# EAGLE design 7segement4digits1badidea-shield-mk-5 (EAGLE 6.5.0)
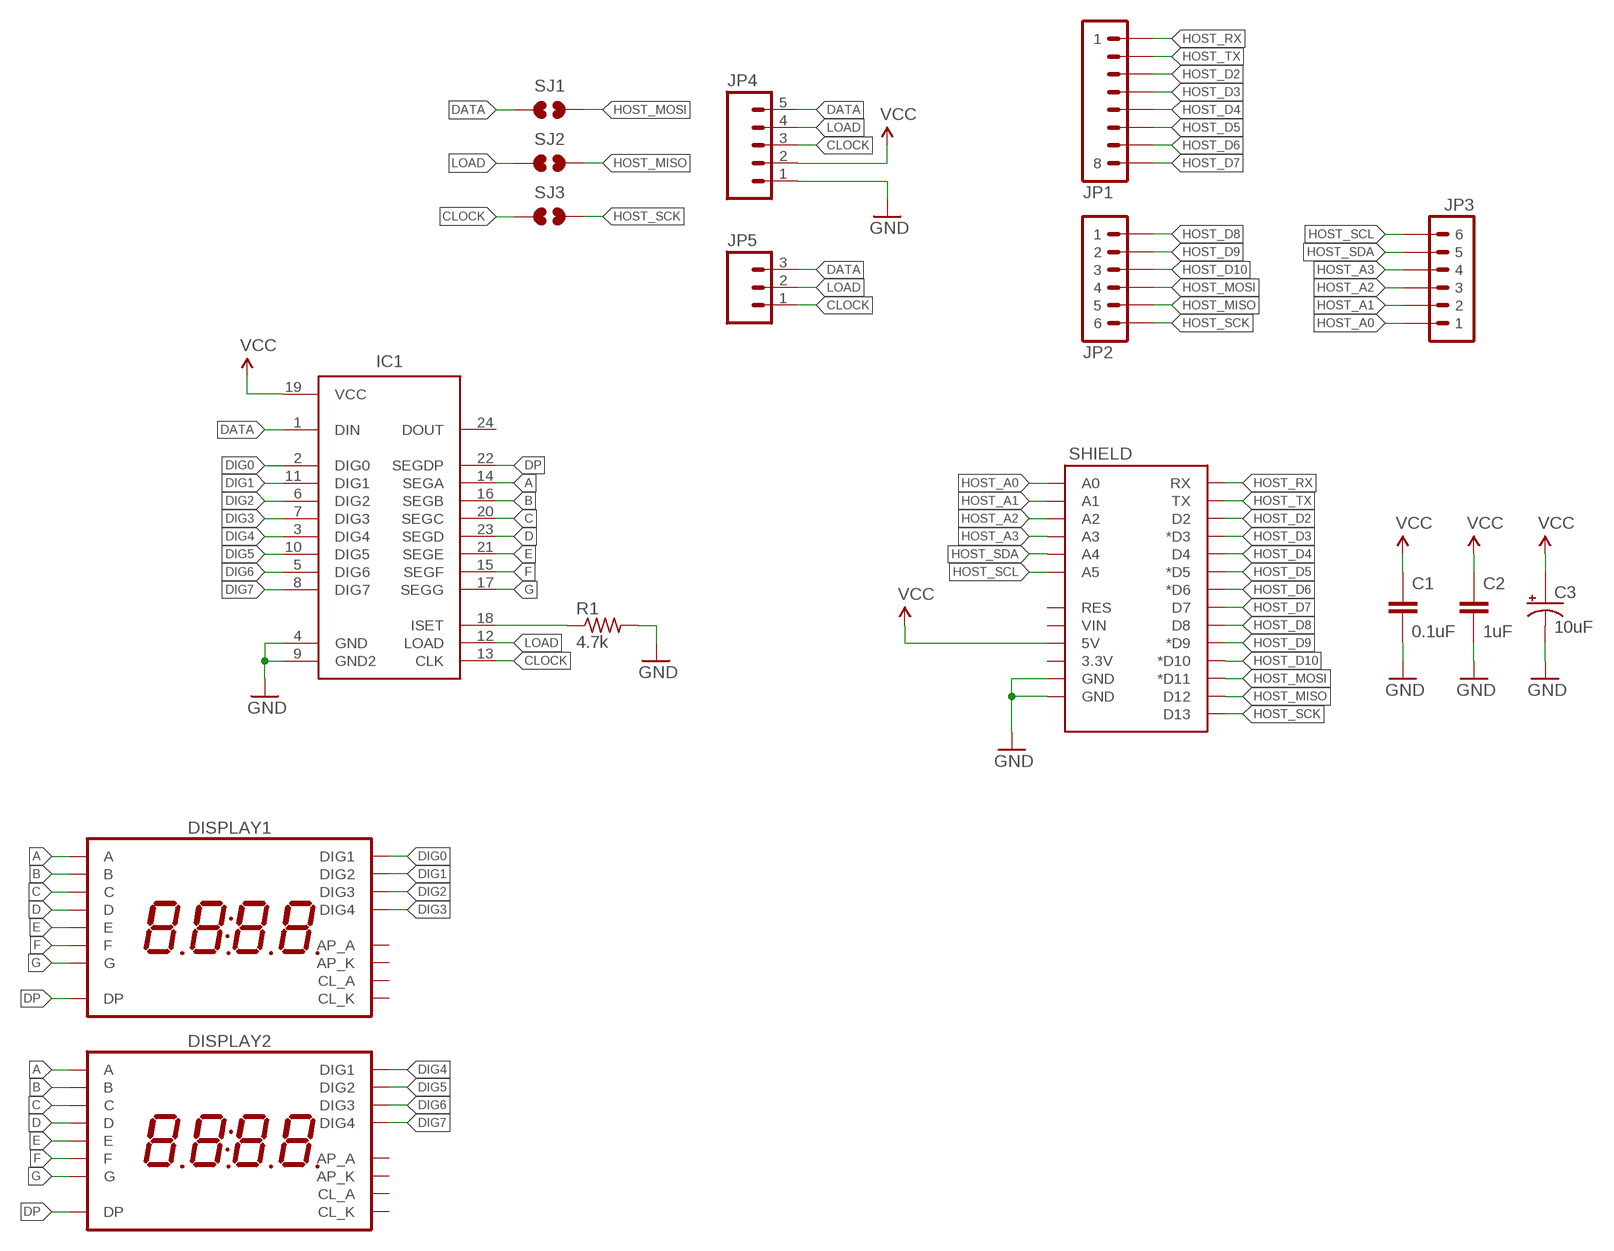
[diagram p0: schematic, sheet 1]

## Parts
C1  0.1uF  CAPACITOR-CERAMIC025-024X044  [C025-024X044]
C2  1uF  CAPACITOR-CERAMIC025-024X044  [C025-024X044]
C3  10uF  CAPACITOR-POLARIZEDE2.5-6  [E2,5-6]
DISPLAY1  7SEG_4DIGIT_10MM  [7SEG_4DIG_10MM]
DISPLAY2  7SEG_4DIGIT_10MM  [7SEG_4DIG_10MM]
IC1  MAX7219DIP  [DIL24]
JP1  M08NOT-SHITTY-NO-SILK  [1X08_NS]
JP2  M06SIP  [1X06]
JP3  M06SIP  [1X06]
JP4  M05PTH  [1X05]
JP5  M031X03_NO_SILK  [1X03_NO_SILK]
R1  4.7k  RESISTORPTH-AXIAL-5.08MM  [RESISTOR-AXIAL-PTH-5.08MM]
SHIELD  ARDUINO_SHIELD_SMALLERNEKKID  [ARDUINO_SHIELD_SMALLER_NEKKID]
SJ1  JUMPER-PAD-2-NOYES_SILK  [PAD-JUMPER-2-NO_YES_SILK]
SJ2  JUMPER-PAD-2-NOYES_SILK  [PAD-JUMPER-2-NO_YES_SILK]
SJ3  JUMPER-PAD-2-NOYES_SILK  [PAD-JUMPER-2-NO_YES_SILK]

## Nets
A: DISPLAY1.14(A) DISPLAY2.14(A) IC1.14(SEGA)
B: DISPLAY1.16(B) DISPLAY2.16(B) IC1.16(SEGB)
C: DISPLAY1.13(C) DISPLAY2.13(C) IC1.20(SEGC)
CLOCK: IC1.13(CLK) JP4.3 JP5.1 SJ3.1
D: DISPLAY1.3(D) DISPLAY2.3(D) IC1.23(SEGD)
DATA: IC1.1(DIN) JP4.5 JP5.3 SJ1.1
DIG0: DISPLAY1.1(DIG1) IC1.2(DIG0)
DIG1: DISPLAY1.2(DIG2) IC1.11(DIG1)
DIG2: DISPLAY1.6(DIG3) IC1.6(DIG2)
DIG3: DISPLAY1.8(DIG4) IC1.7(DIG3)
DIG4: DISPLAY2.1(DIG1) IC1.3(DIG4)
DIG5: DISPLAY2.2(DIG2) IC1.10(DIG5)
DIG6: DISPLAY2.6(DIG3) IC1.5(DIG6)
DIG7: DISPLAY2.8(DIG4) IC1.8(DIG7)
DP: DISPLAY1.7(DP) DISPLAY2.7(DP) IC1.22(SEGDP)
E: DISPLAY1.5(E) DISPLAY2.5(E) IC1.21(SEGE)
F: DISPLAY1.11(F) DISPLAY2.11(F) IC1.15(SEGF)
G: DISPLAY1.15(G) DISPLAY2.15(G) IC1.17(SEGG)
GND: C1.2 C2.2 C3.- IC1.4(GND) IC1.9(GND2) JP4.1 R1.P$2 SHIELD.GND@0(GND) SHIELD.GND@1(GND)
HOST_A0: JP3.1 SHIELD.A0
HOST_A1: JP3.2 SHIELD.A1
HOST_A2: JP3.3 SHIELD.A2
HOST_A3: JP3.4 SHIELD.A3
HOST_D2: JP1.3 SHIELD.D2
HOST_D3: JP1.4 SHIELD.D3(*D3)
HOST_D4: JP1.5 SHIELD.D4
HOST_D5: JP1.6 SHIELD.D5(*D5)
HOST_D6: JP1.7 SHIELD.D6(*D6)
HOST_D7: JP1.8 SHIELD.D7
HOST_D8: JP2.1 SHIELD.D8
HOST_D9: JP2.2 SHIELD.D9(*D9)
HOST_D10: JP2.3 SHIELD.D10(*D10)
HOST_MISO: JP2.5 SHIELD.D12 SJ2.2
HOST_MOSI: JP2.4 SHIELD.D11(*D11) SJ1.2
HOST_RX: JP1.1 SHIELD.RX
HOST_SCK: JP2.6 SHIELD.D13 SJ3.2
HOST_SCL: JP3.6 SHIELD.A5
HOST_SDA: JP3.5 SHIELD.A4
HOST_TX: JP1.2 SHIELD.TX
LOAD: IC1.12(LOAD) JP4.4 JP5.2 SJ2.1
N$19: IC1.18(ISET) R1.P$1
VCC: C1.1 C2.1 C3.+ IC1.19(VCC) JP4.2 SHIELD.5V
Unconnected: DISPLAY1.4(CL_A) DISPLAY1.9(AP_K) DISPLAY1.10(AP_A) DISPLAY1.12(CL_K) DISPLAY2.4(CL_A) DISPLAY2.9(AP_K) DISPLAY2.10(AP_A) DISPLAY2.12(CL_K) IC1.24(DOUT) SHIELD.3.3V SHIELD.RES SHIELD.VIN

## Library data of the parts
C1 C2 = A_butts:CAPACITOR-CERAMIC: CAPACITOR, European symbol
C3 = A_butts:CAPACITOR-POLARIZED: POLARIZED CAPACITOR, American symbol
DISPLAY1 DISPLAY2 = A_butts:7SEG_4DIGIT_10MM
IC1 = A_butts:MAX7219: 8-digit, 8-segment LED display driver, serial input
JP1 = A_butts:M08: Header 8 Standard 8-pin 0.1" header. Use with straight break away headers (SKU : PRT-00116), right angle break away headers (PRT-00553), swiss pins (PRT-00743), machine pins (PRT-00117), and female headers (PRT-00115).
JP2 JP3 = A_butts:M06: Header 6 Standard 6-pin 0.1" header. Use with straight break away headers (SKU : PRT-00116), right angle break away headers (PRT-00553), swiss pins (PRT-00743), machine pins (PRT-00117), and female headers (PRT-00115). Molex polarized connector foot print use with SKU : PRT-08094 with associated crimp pins and housings. NOTES ON THE VARIANTS LOCK and LOCK_LONGPADS... This footprint was designed to help hold the alignment of a through-hole component (i.e. 6-pin header) while soldering it into place. You may notice that each hole has been shifted either up or down by 0.005 of an inch from it's more standard position (which is a perfectly straight line). This slight alteration caused the pins (the squares in the middle) to touch the edges of the holes. Because they are alternating, it causes a "brace" to hold the component in place. 0.005 has proven to be the perfect amount of "off-center" position when using our standard breakaway headers. Although looks a little odd when you look at the bare footprint, once you have a header in there, the alteration is very hard to notice. Also,if you push a header all the way into place, it is covered up entirely on the bottom side. This idea of altering the position of holes to aid alignment will be further integrated into the Sparkfun Library for other footprints. It can help hold any component with 3 or more connection pins.
JP4 = A_butts:M05: Header 5 Standard 5-pin 0.1" header. Use with straight break away headers (SKU : PRT-00116), right angle break away headers (PRT-00553), swiss pins (PRT-00743), machine pins (PRT-00117), and female headers (PRT-00115). Molex polarized connector foot print use with SKU : PRT-08230 with associated crimp pins and housings.
JP5 = A_butts:M03: Header 3 Standard 3-pin 0.1" header. Use with straight break away headers (SKU : PRT-00116), right angle break away headers (PRT-00553), swiss pins (PRT-00743), machine pins (PRT-00117), and female headers (PRT-00115). Molex polarized connector foot print use with SKU : PRT-08232 with associated crimp pins and housings.
R1 = A_butts:RESISTOR: RESISTOR, American symbol
SHIELD = A_butts:ARDUINO_SHIELD_SMALLER
SJ1-SJ3 = A_butts:JUMPER-PAD-2-NO

## Board
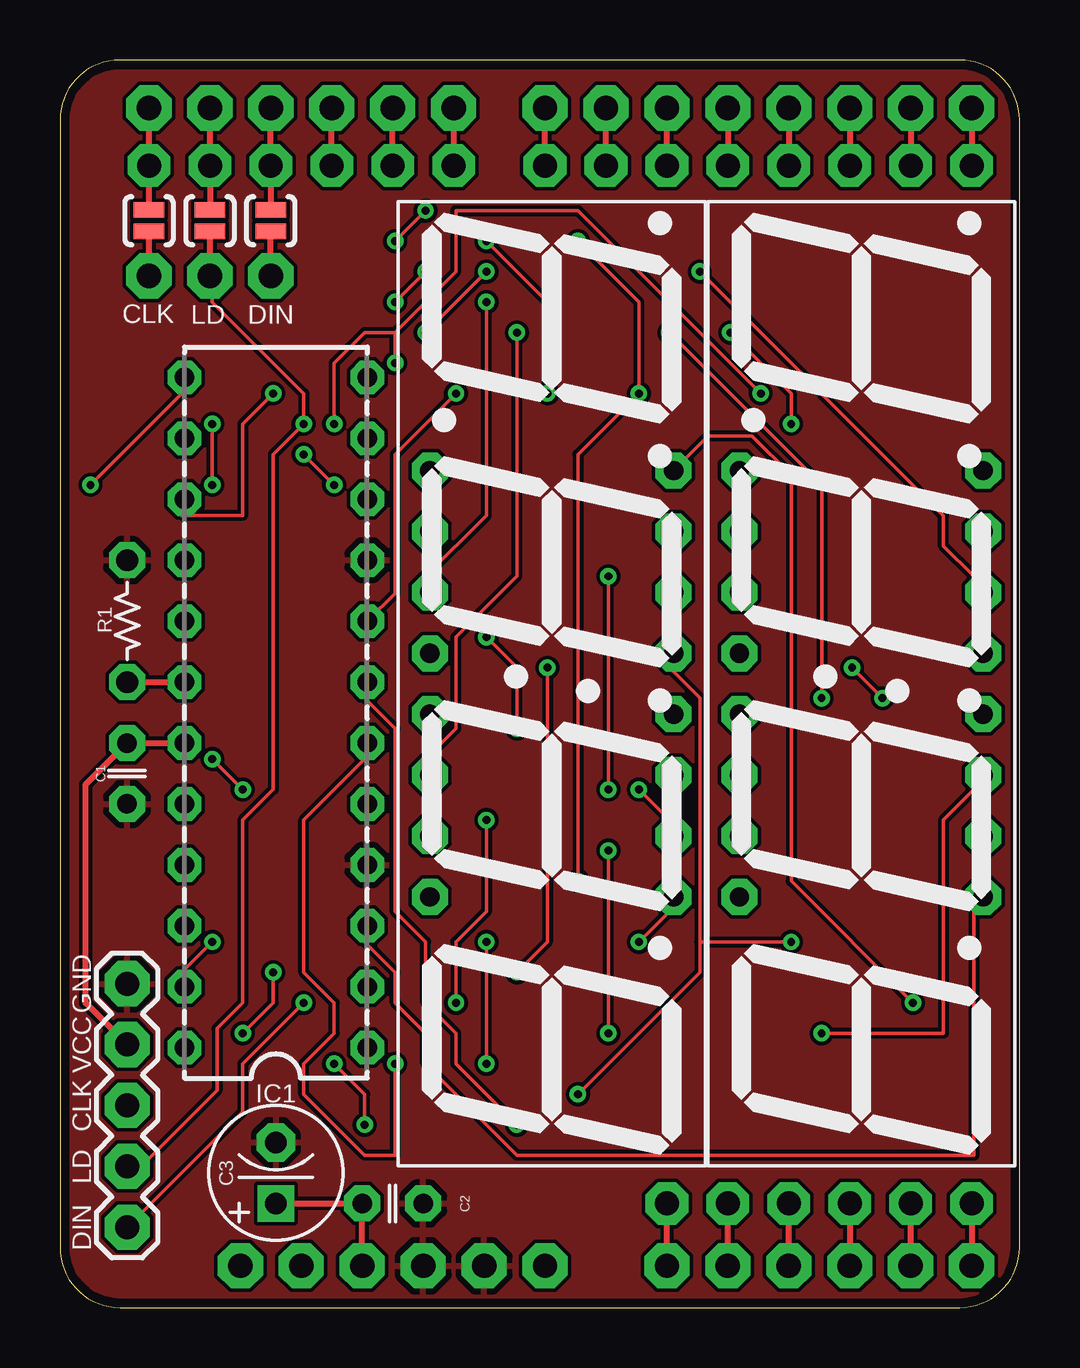
[diagram p1: board, top side]
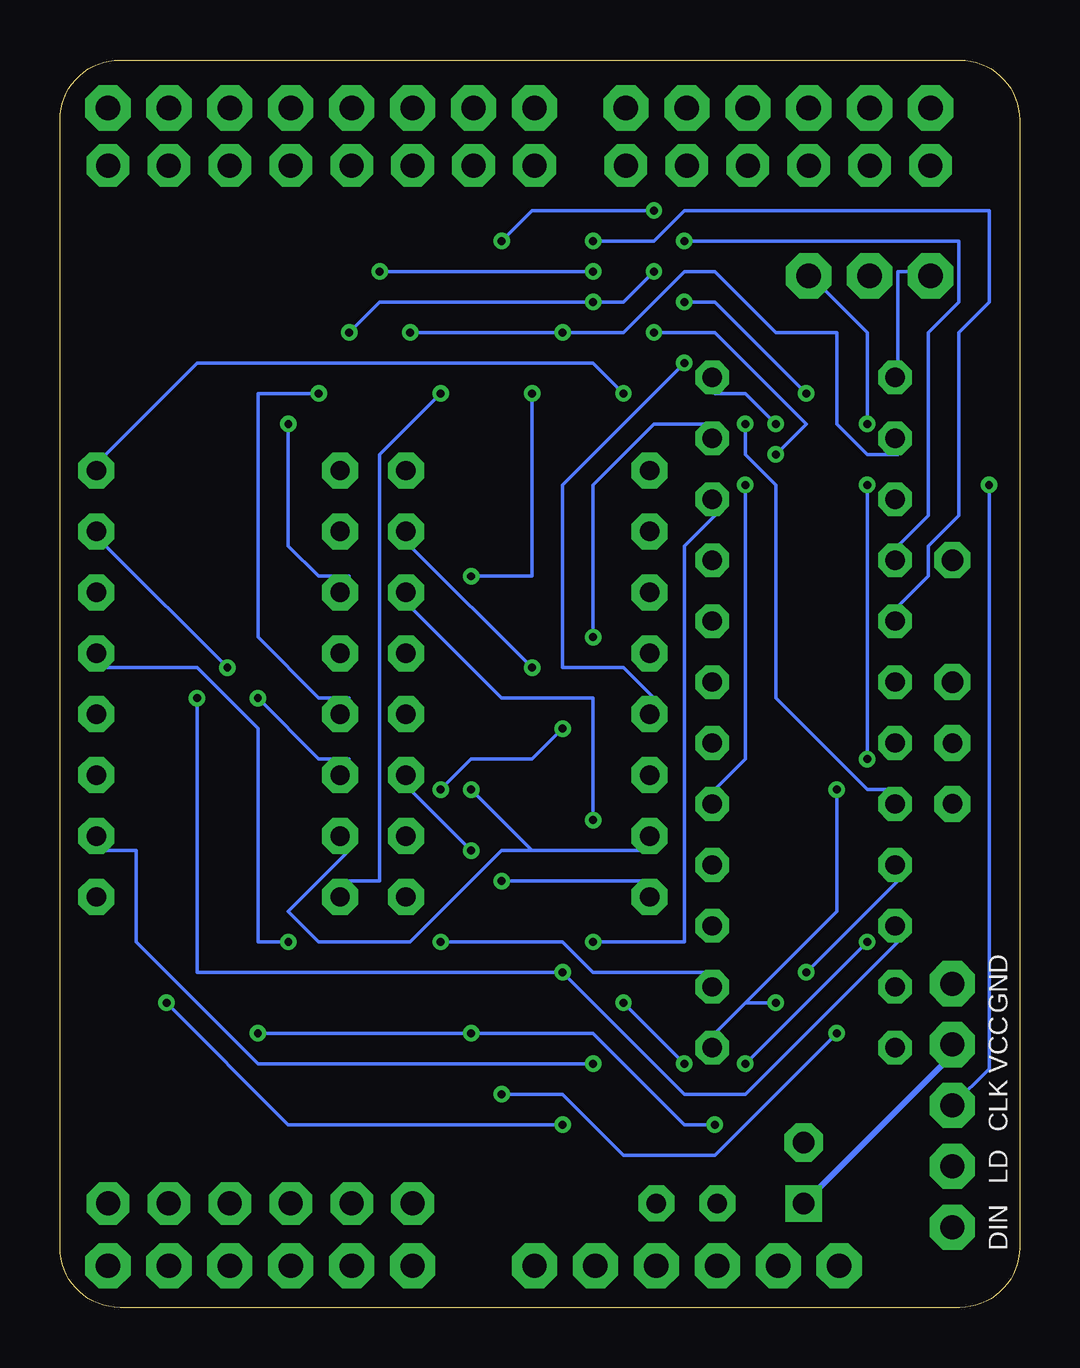
[diagram p2: board, bottom side, seen from below]

Size 40 x 52 mm. Coordinates in mm from the lower left corner, seen from the top.
Outline: 2.5,0 37.5,0 arc90 40,2.5 40,49.5 arc90 37.5,52 2.5,52 arc90 0,49.5 0,2.5 arc90 2.5,0
Copper layers (1*16): Top 0.0356mm / dielectric 1.5011mm / Bottom 0.0356mm
Design rules "LaenPCBOrder_2": minimum track width 6mil, minimum drill 13mil, track to track 6mil, track to pad 6mil, pad to pad 6mil, via to via 6mil, smd to smd 6mil, copper to edge 15mil, drill to drill 6mil, minimum pad ring 7mil, minimum via ring 7mil, stop-mask expansion 3mil, vias tented up to drill 20mil, thermal gap 10mil

### Footprints (pad centres in the part's own frame; a part is rotated, then mirrored left to right if it is on the bottom)
C025-024X044 = drill 0.813 pad 1.5 octagon: 1 -1.27,0; 2 1.27,0
E2,5-6 = drill 0.9 pad 1.524 square: + -1.27,0 | drill 0.9 pad 1.6 octagon: - 1.27,0
7SEG_4DIG_10MM = drill 0.8 pad 1.5 octagon: 1 -8.89,-5.08; 2 -6.35,-5.08; 3 -3.81,-5.08; 4 -1.27,-5.08; 5 1.27,-5.08; 6 3.81,-5.08; 7 6.35,-5.08; 8 8.89,-5.08; 9 8.89,5.08; 10 6.35,5.08; 11 3.81,5.08; 12 1.27,5.08; 13 -1.27,5.08; 14 -3.81,5.08; 15 -6.35,5.08; 16 -8.89,5.08
DIL24 = drill 0.8 pad 1.4 octagon: 1 -13.97,-3.81; 2 -11.43,-3.81; 3 -8.89,-3.81; 4 -6.35,-3.81; 5 -3.81,-3.81; 6 -1.27,-3.81; 7 1.27,-3.81; 8 3.81,-3.81; 9 6.35,-3.81; 10 8.89,-3.81; 11 11.43,-3.81; 12 13.97,-3.81; 13 13.97,3.81; 14 11.43,3.81; 15 8.89,3.81; 16 6.35,3.81; 17 3.81,3.81; 18 1.27,3.81; 19 -1.27,3.81; 20 -3.81,3.81; 21 -6.35,3.81; 22 -8.89,3.81; 23 -11.43,3.81; 24 -13.97,3.81
1X08_NS = drill 1 pad 1.778 octagon: 1 0,0; 2 2.54,0; 3 5.08,0; 4 7.62,0; 5 10.16,0; 6 12.7,0; 7 15.24,0; 8 17.78,0
1X06 = drill 1 pad 1.778 octagon: 1 0,0; 2 2.54,0; 3 5.08,0; 4 7.62,0; 5 10.16,0; 6 12.7,0
1X05 = drill 1 pad 1.88 octagon: 1 0,0; 2 2.54,0; 3 5.08,0; 4 7.62,0; 5 10.16,0
1X03_NO_SILK = drill 1.016 pad 1.88 octagon: 1 0,0; 2 2.54,0; 3 5.08,0
RESISTOR-AXIAL-PTH-5.08MM = drill 0.9 pad 1.5 octagon: P$1 -2.54,0; P$2 2.54,0
ARDUINO_SHIELD_SMALLER_NEKKID = drill 1.016 pad 1.88 octagon: 3.3V 48.26,-27.94; 5V 48.26,-25.4; A0 48.26,-12.7; A1 48.26,-10.16; A2 48.26,-7.62; A3 48.26,-5.08; A4 48.26,-2.54; A5 48.26,0; D2 0,-5.08; D3 0,-7.62; D4 0,-10.16; D5 0,-12.7; D6 0,-15.24; D7 0,-17.78; D8 0,-21.59; D9 0,-24.13; D10 0,-26.67; D11 0,-29.21; D12 0,-31.75; D13 0,-34.29; GND@0 48.26,-22.86; GND@1 48.26,-20.32; RES 48.26,-30.48; RX 0,0; TX 0,-2.54; VIN 48.26,-17.78
PAD-JUMPER-2-NO_YES_SILK = smd 0.635 x 1.27: 1 -0.45,0; 2 0.45,0

### Placement (x,y rotation side)
C1  2.8,22.26 270 top
C2  13.87,4.34 0 top
C3  9,5.61 90 top
DISPLAY1  20.5,26 90 top
DISPLAY2  33.4,26 90 top
IC1  9,24.8 90 top
JP1  38,47.6 180 top
JP2  16.41,47.6 180 top
JP3  25.3,4.34 0 top
JP4  2.8,13.5 270 top
JP5  3.71,43 0 top
R1  2.8,28.61 90 top
SHIELD  38,50 270 top
SJ1  8.79,45.3 90 top
SJ2  6.25,45.3 90 top
SJ3  3.71,45.3 90 top

### Tracks (layer width: path | path; a pad name or v marks a point on that pad's centre or on a via)
A  (via drill 0.33)
  Top 0.152: v19.05,40.64 19.05,30.48 16.51,27.94 16.51,24.13 15.24,22.86 DISPLAY1.14 | v31.75,25.4 31.75,34.29 v25.4,40.64
  Bottom 0.152: IC1.14 5.08,35.56 6.35,35.56 7.62,36.83 7.62,40.64 10.16,40.64 12.7,43.18 13.97,43.18 16.51,40.64 v19.05,40.64 v25.4,40.64 | v31.75,25.4 29.21,22.86 27.94,22.86 DISPLAY2.14
B  (via drill 0.33)
  Top 0.152: v15.24,45.72 v13.97,44.45 | v21.59,44.45 24.13,41.91 v24.13,38.1 21.59,35.56 v21.59,17.78
  Bottom 0.152: v13.97,44.45 2.54,44.45 2.54,41.91 3.81,40.64 3.81,33.02 5.08,31.75 IC1.16 | v15.24,45.72 20.32,45.72 v21.59,44.45 | v24.13,38.1 26.67,35.56 26.67,17.78 27.94,17.78 DISPLAY2.16 | v21.59,17.78 15.24,17.78 DISPLAY1.16
C  (via drill 0.33)
  Top 0.152: v11.43,36.83 11.43,39.37 12.7,40.64 13.97,40.64 | v13.97,39.37 13.97,40.64 | v29.21,38.1 21.59,45.72 16.51,45.72 16.51,43.18 13.97,40.64
  Bottom 0.152: v11.43,36.83 11.43,35.56 10.16,34.29 10.16,25.4 6.35,21.59 5.08,21.59 IC1.20 | v13.97,39.37 19.05,34.29 19.05,26.67 16.51,26.67 15.24,25.4 DISPLAY1.13 | v29.21,38.1 31.75,38.1 31.75,27.94 29.21,25.4 27.94,25.4 DISPLAY2.13
CLOCK  (via drill 0.33)
  Top 0.152: v1.27,34.29 5.08,38.1 IC1.13
  Top 0.25: JP5.1 SJ3.1
  Bottom 0.152: IC1.13 5.08,39.37 5.08,43.18 3.81,43.18 JP5.1 | v1.27,34.29 1.27,9.95 JP4.3
D  (via drill 0.33)
  Top 0.152: v6.35,15.24 5.08,13.97 IC1.23 | v11.43,10.16 12.7,8.89 v12.7,7.62 | v31.75,11.43 36.83,11.43 36.83,20.32 38.1,21.59 DISPLAY2.3 | v22.86,11.43 v22.86,19.05
  Bottom 0.152: v11.43,10.16 v6.35,15.24 | v12.7,7.62 13.97,7.62 17.78,11.43 v22.86,11.43 v31.75,11.43 | v22.86,19.05 25.4,21.59 DISPLAY1.3
DATA  (via drill 0.33)
  Top 0.152: v10.16,12.7 7.62,10.16 7.62,8.16 JP4.5 | v6.35,34.29 v6.35,36.83 | v7.62,21.59 v6.35,22.86
  Top 0.25: JP5.3 SJ1.1
  Bottom 0.152: 11.43,12.7 12.7,11.43 IC1.1 | v10.16,12.7 11.43,12.7 | v6.35,36.83 6.35,40.64 8.89,43.18 JP5.3 | v6.35,22.86 v6.35,34.29 | v7.62,21.59 7.62,16.51 11.43,12.7
DIG0  (via drill 0.33)
  Top 0.152: v24.13,15.24 25.4,16.51 DISPLAY1.1
  Bottom 0.152: v24.13,15.24 19.05,15.24 17.78,13.97 12.7,13.97 IC1.2
DIG1  (via drill 0.33)
  Top 0.152: v17.78,27.94 19.05,26.67 v19.05,24.13 | v24.13,21.59 25.4,20.32 DISPLAY1.2
  Bottom 0.152: v17.78,27.94 17.78,34.29 15.24,36.83 12.7,36.83 IC1.11 | v19.05,24.13 20.32,22.86 22.86,22.86 v24.13,21.59
DIG2  (via drill 0.33)
  Top 0.152: v13.97,10.16 13.97,6.35 12.7,6.35 10.16,8.89 10.16,10.16 11.43,11.43 11.43,12.7 10.16,13.97 10.16,20.32 12.7,22.86 IC1.6 | v16.51,12.7 16.51,15.24 17.78,16.51 v17.78,20.32
  Bottom 0.152: v16.51,12.7 v13.97,10.16 | v17.78,20.32 17.78,25.4 21.59,25.4 25.4,29.21 DISPLAY1.6
DIG3  (via drill 0.33)
  Top 0.152: v19.05,7.62 16.51,10.16 16.51,11.43 15.24,12.7 15.24,15.24 13.97,16.51 13.97,24.13 12.7,25.4 IC1.7 | v35.56,12.7 30.48,17.78 30.48,34.69 28.84,36.33 27.02,36.33 DISPLAY1.8
  Bottom 0.152: v19.05,7.62 30.48,7.62 v35.56,12.7
DIG4
  Top 0.152: IC1.3 12.7,15.24 13.97,13.97 13.97,12.7 15.24,11.43 15.24,10.16 19.05,6.35 38.1,6.35 38.1,16.51 DISPLAY2.1
DIG5  (via drill 0.33)
  Top 0.152: v17.78,10.16 v17.78,15.24
  Bottom 0.152: v17.78,15.24 13.97,15.24 13.97,31.75 12.7,33.02 IC1.10 | v17.78,10.16 31.75,10.16 36.83,15.24 36.83,19.05 38.1,19.05 DISPLAY2.2
DIG6  (via drill 0.33)
  Top 0.152: v10.16,35.56 v11.43,34.29 | v17.78,43.18 v15.24,40.64 | v26.67,43.18 36.83,33.02 36.83,31.75 38.1,30.48 DISPLAY2.6
  Bottom 0.152: v11.43,34.29 11.43,22.86 12.7,21.59 IC1.5 | v10.16,35.56 8.89,36.83 12.7,40.64 v15.24,40.64 | v26.67,43.18 v17.78,43.18
DIG7  (via drill 0.33)
  Top 0.152: v16.51,38.1 13.97,35.56 13.97,29.77 IC1.8
  Bottom 0.152: v16.51,38.1 17.78,39.37 34.29,39.37 38.1,35.56 DISPLAY2.8
DP  (via drill 0.33)
  Top 0.152: v19.05,13.97 20.32,15.24 v20.32,26.67 | v34.29,25.4 v33.02,26.67
  Bottom 0.152: v20.32,26.67 25.4,31.75 DISPLAY1.7 | IC1.22 5.08,15.24 11.43,8.89 13.97,8.89 v19.05,13.97 34.29,13.97 v34.29,25.4 | v33.02,26.67 38.1,31.75 DISPLAY2.7
E  (via drill 0.33)
  Top 0.152: v8.89,13.97 8.89,12.7 v7.62,11.43 | v21.59,8.89 26.67,13.97 26.67,15.24 | 26.67,15.24 26.67,25.4 25.4,26.67 DISPLAY1.5 | 26.67,15.24 v30.48,15.24
  Bottom 0.152: v8.89,13.97 5.08,17.78 IC1.21 | v7.62,11.43 12.7,6.35 16.51,6.35 19.05,8.89 v21.59,8.89 | v30.48,15.24 31.75,15.24 31.75,24.13 34.29,26.67 38.1,26.67 DISPLAY2.5
F  (via drill 0.33)
  Top 0.152: v8.89,38.1 7.62,36.83 7.62,33.02 5.08,33.02 IC1.15 | v15.24,43.18 v13.97,41.91 | v17.78,41.91 17.78,33.02 15.24,30.48 DISPLAY1.11 | v30.48,36.83 30.48,38.1 v27.94,40.64
  Bottom 0.152: v8.89,38.1 12.7,41.91 v13.97,41.91 | v15.24,43.18 16.51,41.91 v17.78,41.91 26.67,41.91 v27.94,40.64 | v30.48,36.83 30.48,31.75 29.21,30.48 27.94,30.48 DISPLAY2.11
G  (via drill 0.33)
  Top 0.152: v17.78,44.45 20.32,41.91 v20.32,38.1 | v22.86,21.59 v22.86,30.48
  Bottom 0.152: v17.78,44.45 15.24,44.45 13.97,45.72 1.27,45.72 1.27,41.91 2.54,40.64 2.54,33.02 3.81,31.75 3.81,30.48 5.08,29.21 IC1.17 | v20.32,38.1 20.32,30.48 v22.86,30.48 | 20.32,19.05 v22.86,21.59 | 20.32,19.05 15.24,19.05 DISPLAY1.15 | 20.32,19.05 21.59,19.05 25.4,15.24 29.21,15.24 30.48,16.51 27.94,19.05 DISPLAY2.15
GND
  pour Top: 0,2.5 0,49.5 arc-90 2.5,52 37.5,52 arc-90 40,49.5 40,2.5 arc-90 37.5,0 2.5,0 arc-90
HOST_A0
  Top 0.25: SHIELD.A0 JP3.1
HOST_A1
  Top 0.25: SHIELD.A1 JP3.2
HOST_A2
  Top 0.25: SHIELD.A2 JP3.3
HOST_A3
  Top 0.25: JP3.4 SHIELD.A3
HOST_D2
  Top 0.25: SHIELD.D2 JP1.3
HOST_D3
  Top 0.25: SHIELD.D3 JP1.4
HOST_D4
  Top 0.25: SHIELD.D4 JP1.5
HOST_D5
  Top 0.25: JP1.6 SHIELD.D5
HOST_D6
  Top 0.25: JP1.7 SHIELD.D6
HOST_D7
  Top 0.25: JP1.8 SHIELD.D7
HOST_D8
  Top 0.25: SHIELD.D8 JP2.1
HOST_D9
  Top 0.25: JP2.2 SHIELD.D9
HOST_D10
  Top 0.25: JP2.3 SHIELD.D10
HOST_MISO
  Top 0.25: SHIELD.D12 JP2.5 SJ2.2
HOST_MOSI
  Top 0.25: SHIELD.D11 JP2.4 SJ1.2
HOST_RX
  Top 0.25: SHIELD.RX JP1.1
HOST_SCK
  Top 0.25: SHIELD.D13 JP2.6 SJ3.2
HOST_SCL
  Top 0.25: JP3.6 SHIELD.A5
HOST_SDA
  Top 0.25: SHIELD.A4 JP3.5
HOST_TX
  Top 0.25: SHIELD.TX JP1.2
LOAD  (via drill 0.33)
  Top 0.152: JP5.2 6.35,43.18 6.35,41.91 10.16,38.1 v10.16,36.83 8.89,35.56 8.89,21.59 7.62,20.32 7.62,12.7 6.55,11.63 6.55,9.05 3.38,5.88 JP4.4
  Top 0.25: JP5.2 SJ2.1
  Bottom 0.152: v10.16,36.83 11.43,38.1 12.7,38.1 IC1.12
N$19
  Top 0.25: R1.P$1 IC1.18
VCC
  Top 0.25: C3.+ C2.1 SHIELD.5V | IC1.19 C1.1 1.07,21.8 1.07,12.69 JP4.2
  Bottom 0.25: JP4.2 2.8,10.54 C3.+

### Text on the board
tPlace: CLK | LD | DIN | GND | VCC | CLK | LD | DIN
bPlace: GND | VCC | CLK | LD | DIN